# EAGLE design mainAD2S1200 (EAGLE 7.2.0)
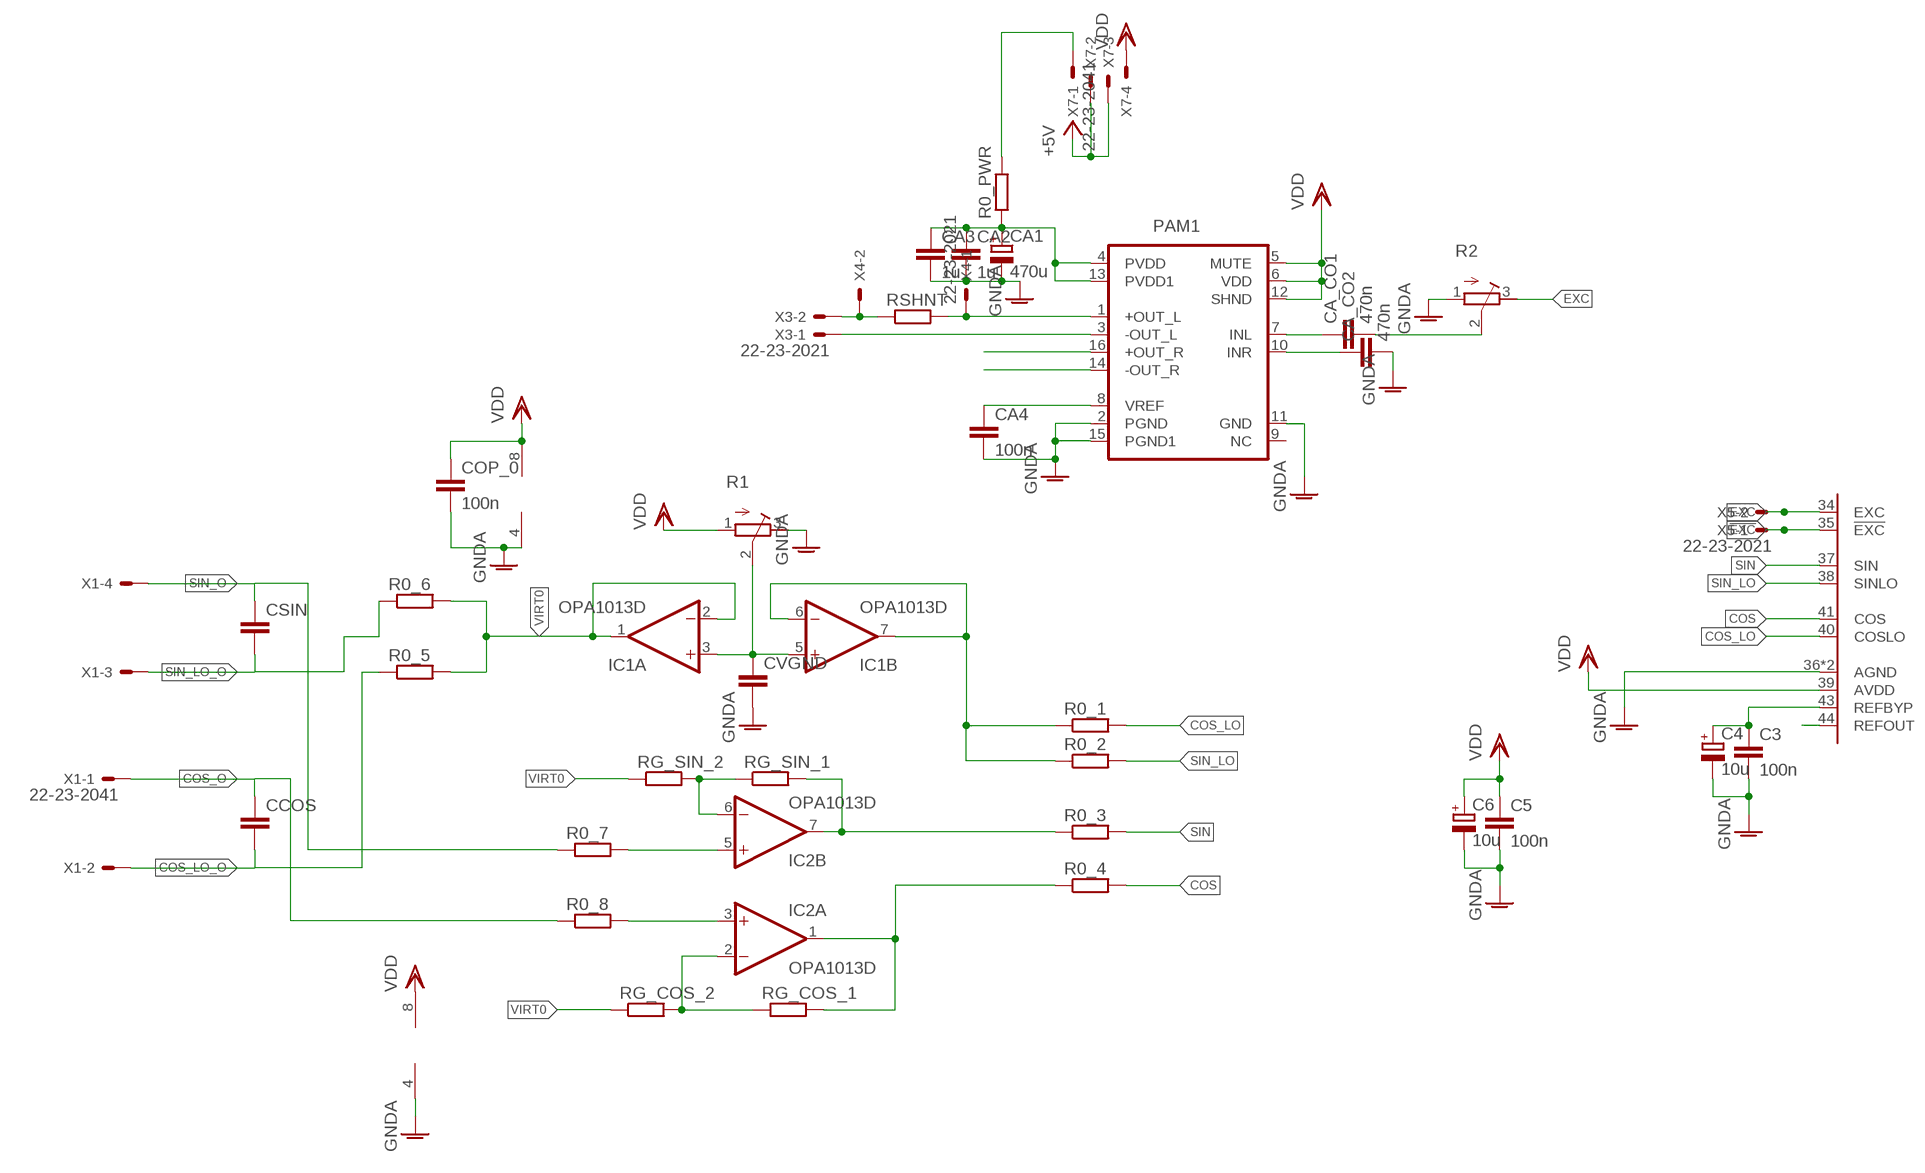
[diagram p0: schematic, sheet 1, part 1 of 2]
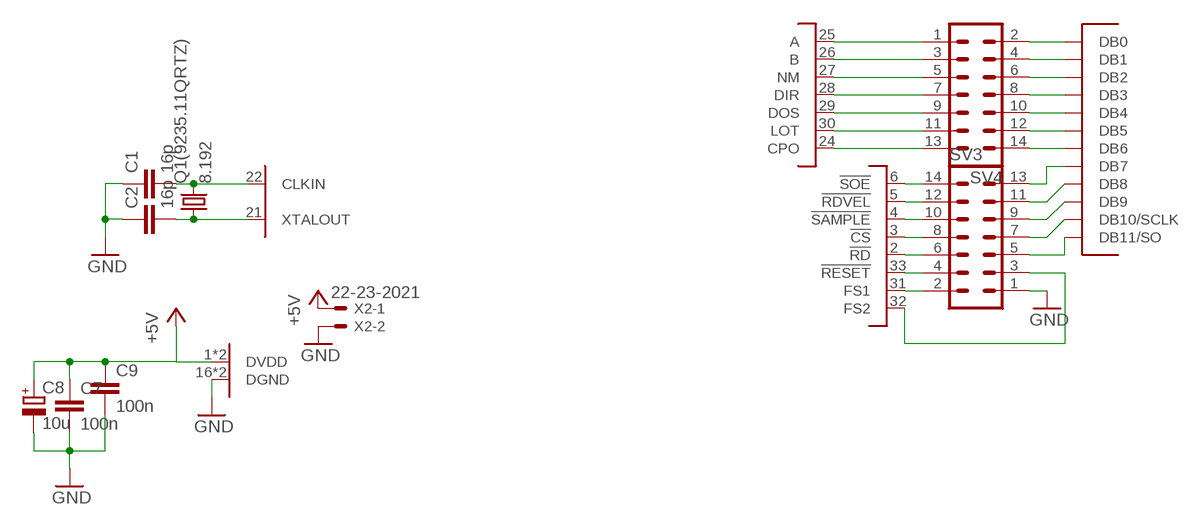
[diagram p1: schematic, sheet 1, part 2 of 2]

## Parts
C1  16p  C-EUC0805  [C0805]
C2  16p  C-EUC0805  [C0805]
C3  100n  C-EUC0805  [C0805]
C4  10u  CPOL-EUSMCA  [SMC_A]
C5  100n  C-EUC0805  [C0805]
C6  10u  CPOL-EUSMCA  [SMC_A]
C7  100n  C-EUC0805  [C0805]
C8  10u  CPOL-EUSMCA  [SMC_A]
C9  100n  C-EUC0805  [C0805]
CA1  470u  CPOL-EUE10-25  [EB25D]
CA2  1u  C-EUC1206  [C1206]
CA3  1u  C-EUC1206  [C1206]
CA4  100n  C-EUC0805  [C0805]
CA_CO1  470n  C-EUC0805  [C0805]
CA_CO2  470n  C-EUC0805  [C0805]
CCOS  C-EUC0805  [C0805]
COP_0  100n  C-EUC0805  [C0805]
CSIN  C-EUC0805  [C0805]
CVGND  C-EUC0805  [C0805]
IC1  OPA1013D  [SO08]
IC2  OPA1013D  [SO08]
PAM1  PAM8403  [SOP-16]
Q1(9235.11QRTZ)  8.192  CRYSTALCTS406  [CTS406]
R0_1  R-EU_R0805  [R0805]
R0_2  R-EU_R0805  [R0805]
R0_3  R-EU_R0805  [R0805]
R0_4  R-EU_R0805  [R0805]
R0_5  R-EU_R0805  [R0805]
R0_6  R-EU_R0805  [R0805]
R0_7  R-EU_R0805  [R0805]
R0_8  R-EU_R0805  [R0805]
R0_PWR  R-EU_R0805  [R0805]
R1  R-TRIMM64X  [RTRIM64X]
R2  R-TRIMM64X  [RTRIM64X]
RG_COS_1  R-EU_R0805  [R0805]
RG_COS_2  R-EU_R0805  [R0805]
RG_SIN_1  R-EU_R0805  [R0805]
RG_SIN_2  R-EU_R0805  [R0805]
RSHNT  R-EU_R0805  [R0805]
SV3  ML14  [ML14]
SV4  ML14  [ML14]
U$1  AD1S1200  [TQFP-44]
X1  22-23-2041  [22-23-2041]
X2  22-23-2021  [22-23-2021]
X3  22-23-2021  [22-23-2021]
X4  22-23-2021  [22-23-2021]
X5  22-23-2021  [22-23-2021]
X7  22-23-2041  [22-23-2041]

## Nets
!EXC: U$1.35(!EXC) X5.1
+5V: C7.1 C8.+ C9.1 U$1.1(DVDD) U$1.17(DVDD) X2.1 X7.2 X7.3
COS: R0_4.2 U$1.41(COS)
COS_LO: R0_1.2 U$1.40(COSLO)
COS_LO_O: CCOS.2 R0_5.1 X1.2
COS_O: CCOS.1 R0_8.1 X1.1
EXC: R2.3(E) U$1.34(EXC) X5.2
GND: C1.1 C2.1 C7.2 C8.- C9.2 SV3.1 U$1.16(DGND) U$1.23(DGND) X2.2
GNDA: C3.2 C4.- C5.2 C6.- CA1.- CA2.2 CA3.2 CA4.2 CA_CO2.2 COP_0.2 CVGND.2 IC1.4(P:V-) IC2.4(P:V-) PAM1.2(PGND) PAM1.11(GND) PAM1.15(PGND1) R1.3(E) R2.1(A) U$1.36(AGND) U$1.42(AGND)
N$1: C1.2 Q1(9235.11QRTZ).3 U$1.22(CLKIN)
N$2: C2.2 Q1(9235.11QRTZ).1 U$1.21(XTALOUT)
N$3: CA4.1 PAM1.8(VREF)
N$4: CA_CO1.1 PAM1.7(INL)
N$5: C3.1 C4.+ U$1.43(REFBYP)
N$6: CA_CO2.1 PAM1.10(INR)
N$7: IC1.6(B:-IN) IC1.7(B:OUT) R0_1.1 R0_2.1
N$8: PAM1.1(+OUT_L) RSHNT.2 X4.1
N$9: PAM1.3(-OUT_L) X3.1
N$10: PAM1.16(+OUT_R)
N$11: PAM1.14(-OUT_R)
N$12: IC2.7(B:OUT) R0_3.1 RG_SIN_1.2
N$13: IC2.1(A:OUT) R0_4.1 RG_COS_1.2
N$14: CVGND.1 IC1.3(A:+IN) IC1.5(B:+IN) R1.2(S)
N$15: SV4.2 U$1.20(DB0)
N$16: IC2.5(B:+IN) R0_7.2
N$17: IC2.3(A:+IN) R0_8.2
N$18: SV4.4 U$1.19(DB1)
N$19: IC2.6(B:-IN) RG_SIN_1.1 RG_SIN_2.2
N$20: IC2.2(A:-IN) RG_COS_1.1 RG_COS_2.2
N$21: SV4.6 U$1.18(DB2)
N$22: SV4.12 U$1.13(DB5)
N$23: SV4.14 U$1.12(DB6)
N$24: SV4.8 U$1.15(DB3)
N$25: SV4.10 U$1.14(DB4)
N$26: SV3.5 U$1.7(DB11/SO)
N$27: SV3.7 U$1.8(DB10/SCLK)
N$28: SV3.9 U$1.9(DB9)
N$29: SV3.11 U$1.10(DB8)
N$30: SV3.13 U$1.11(DB7)
N$31: SV4.11 U$1.30(LOT)
N$32: SV4.7 U$1.28(DIR)
N$33: SV4.9 U$1.29(DOS)
N$34: SV4.5 U$1.27(NM)
N$35: SV4.3 U$1.26(B)
N$36: SV4.1 U$1.25(A)
N$37: SV4.13 U$1.24(CPO)
N$38: SV3.6 U$1.2(!RD)
N$39: SV3.8 U$1.3(!CS)
N$40: SV3.10 U$1.4(!SAMPLE)
N$41: SV3.12 U$1.5(!RDVEL)
N$42: SV3.14 U$1.6(!SOE)
N$43: SV3.4 U$1.33(!RESET)
N$44: SV3.2 U$1.31(FS1)
N$45: SV3.3 U$1.32(FS2)
N$46: CA_CO1.2 R2.2(S)
N$47: RSHNT.1 X3.2 X4.2
N$48: CA1.+ CA2.1 CA3.1 PAM1.4(PVDD) PAM1.13(PVDD1) R0_PWR.1
N$49: R0_PWR.2 X7.1
N$50: U$1.44(REFOUT)
SIN: R0_3.2 U$1.37(SIN)
SIN_LO: R0_2.2 U$1.38(SINLO)
SIN_LO_O: CSIN.2 R0_6.1 X1.3
SIN_O: CSIN.1 R0_7.1 X1.4
VDD: C5.1 C6.+ COP_0.1 IC1.8(P:V+) IC2.8(P:V+) PAM1.5(MUTE) PAM1.6(VDD) PAM1.12(SHND) R1.1(A) U$1.39(AVDD) X7.4
VIRT0: IC1.1(A:OUT) IC1.2(A:-IN) R0_5.2 R0_6.2 RG_COS_2.1 RG_SIN_2.1
Unconnected: PAM1.9(NC)

## Library data of the parts
C1-C3 C5 C7 C9 CA4 CCOS COP_0 CSIN CVGND = rcl:C-EU: CAPACITOR, European symbol
C4 C6 C8 CA1 = resistor:CPOL-EU: POLARIZED CAPACITOR, European symbol
CA2 CA3 CA_CO1 CA_CO2 = resistor:C-EU: CAPACITOR, European symbol
IC1 IC2 = linear:OPA1013: OP AMP
PAM1 = PAM8403:PAM8403: Dual channel audio amplifier IC - PAM8403
Q1(9235.11QRTZ) = crystal:CRYSTAL: CRYSTAL; OC_FARNELL: unknown; OC_NEWARK: unknown
R0_1-R0_8 R0_PWR RG_COS_1 RG_COS_2 RG_SIN_1 RG_SIN_2 RSHNT = resistor:R-EU_: RESISTOR, European symbol
R1 R2 = resistor:R-TRIMM: Trimm resistor
SV3 SV4 = con-ml:ML14: HARTING; OC_FARNELL: unknown; OC_NEWARK: unknown
U$1 = ad2s1200:AD1S1200
X1 X7 = con-molex:22-23-2041: .100" (2.54mm) Center Header - 4 Pin; MF: MOLEX; MPN: 22-23-2041; OC_FARNELL: 1462920; OC_NEWARK: 38C0355
X2-X5 = con-molex:22-23-2021: .100" (2.54mm) Center Header - 2 Pin; MF: MOLEX; MPN: 22-23-2021; OC_FARNELL: 1462926; OC_NEWARK: 25C3832

## Board
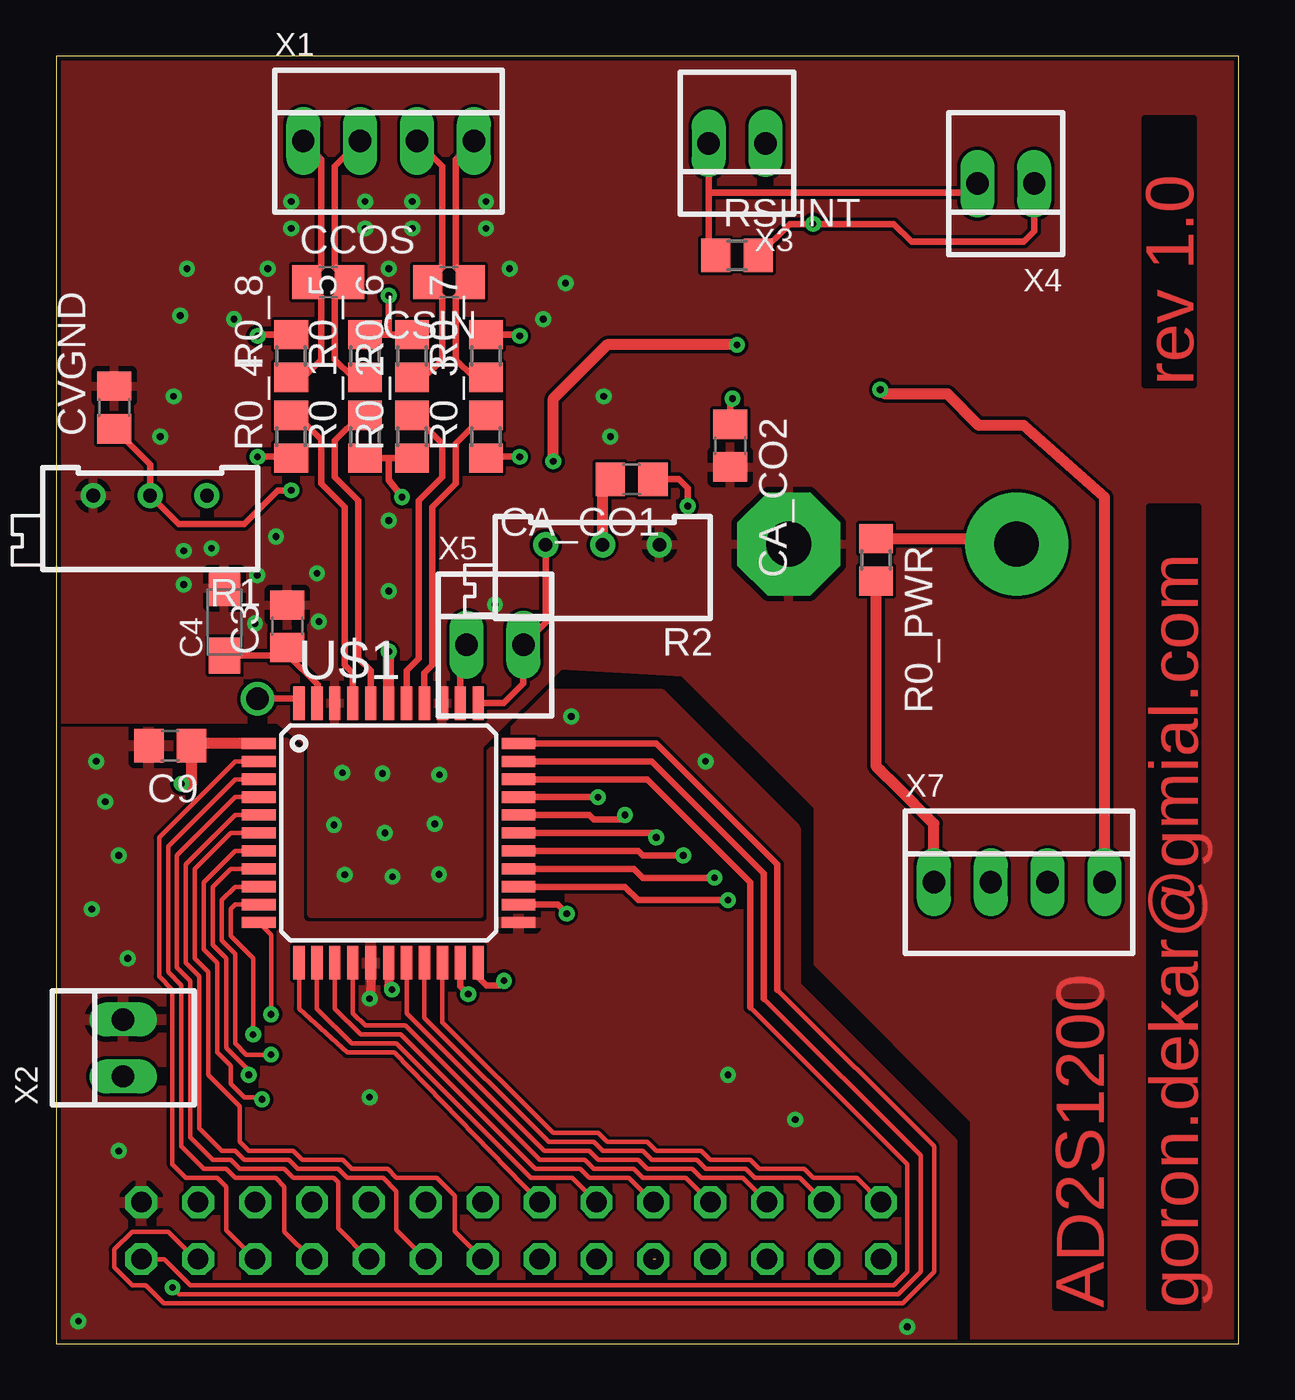
[diagram p2: board, top side]
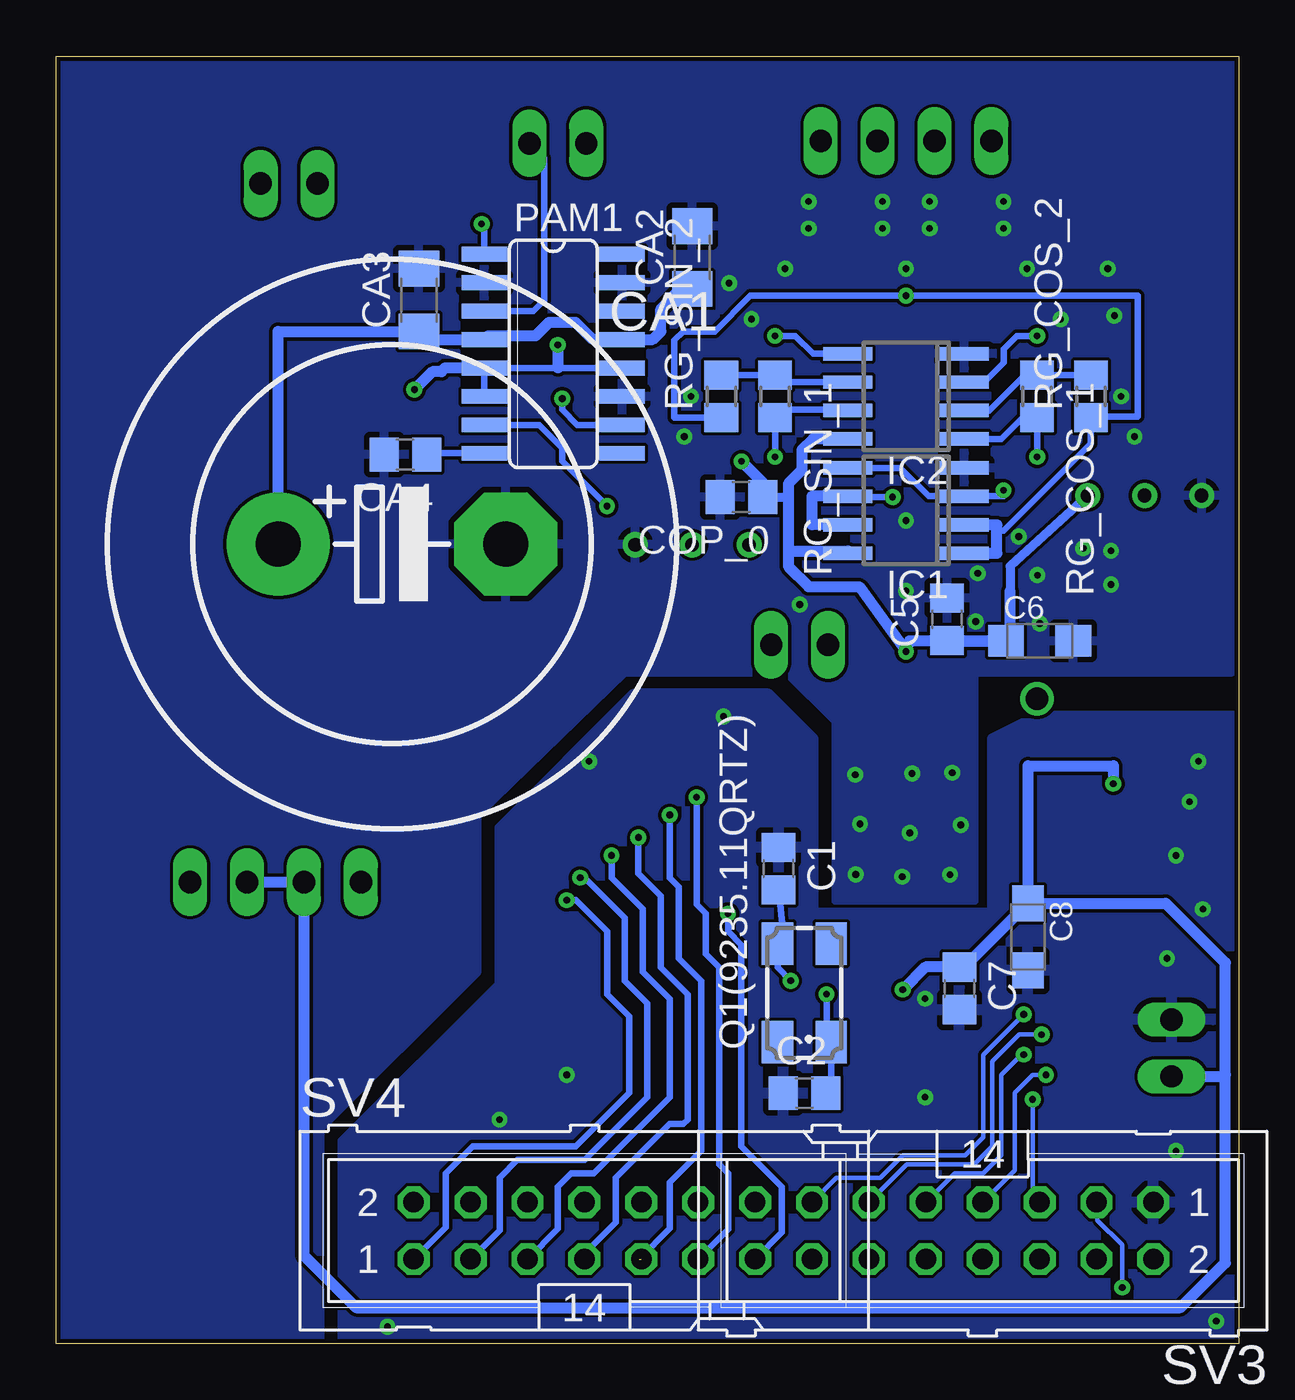
[diagram p3: board, bottom side, seen from below]

Size 52.8 x 57.5 mm. Coordinates in mm from the lower left corner, seen from the top.
Outline: 0,0 52.8,0 52.8,57.5 0,57.5 0,0
Copper layers (1*16): Top 0.018mm / dielectric 1.5mm / Bottom 0.018mm
Design rules "0.15": minimum track width 0.15mm, minimum drill 0.3mm, track to track 0.15mm, track to pad 0.15mm, pad to pad 0.15mm, via to via 0.15mm, smd to smd 0mil, copper to edge 0.2mm, drill to drill 0.2mm, minimum pad ring 10mil, minimum via ring 8mil, stop-mask expansion 4mil, vias tented up to drill 0.5mm, thermal gap 10mil

### Footprints (pad centres in the part's own frame; a part is rotated, then mirrored left to right if it is on the bottom)
C0805 = smd 1.3 x 1.5: 1 -0.95,0; 2 0.95,0
SMC_A = smd 1.6 x 1.4: + -1.5,0; - 1.5,0
EB25D = drill 2.007 pad 4.597: + -5.08,0 | drill 2.007 pad 4.597 octagon: - 5.08,0
C1206 = smd 1.6 x 1.8: 1 -1.4,0; 2 1.4,0
SO08 = smd 0.6 x 2.2: 1 -1.905,-2.6; 2 -0.635,-2.6; 3 0.635,-2.6; 4 1.905,-2.6; 5 1.905,2.6; 6 0.635,2.6; 7 -0.635,2.6; 8 -1.905,2.6
SOP-16 = smd 0.66 x 2.032: 1 -4.445,-3.073; 2 -3.175,-3.073; 3 -1.905,-3.073; 4 -0.635,-3.073; 5 0.635,-3.073; 6 1.905,-3.073; 7 3.175,-3.073; 8 4.445,-3.073; 9 4.445,3.073; 10 3.175,3.073; 11 1.905,3.073; 12 0.635,3.073; 13 -0.635,3.073; 14 -1.905,3.073; 15 -3.175,3.073; 16 -4.445,3.073
CTS406 = smd 1.9 x 1.4: 1 -2.2,-1.2; 2 2.2,-1.2; 3 2.2,1.2; 4 -2.2,1.2
R0805 = smd 1.3 x 1.5: 1 -0.95,0; 2 0.95,0
RTRIM64X = drill 0.61: 1 1.27,-2.54; 2 1.27,0; 3 1.27,2.54
ML14 = drill 0.914 octagon: 1 -7.62,-1.27; 2 -7.62,1.27; 3 -5.08,-1.27; 4 -5.08,1.27; 5 -2.54,-1.27; 6 -2.54,1.27; 7 0,-1.27; 8 0,1.27; 9 2.54,-1.27; 10 2.54,1.27; 11 5.08,-1.27; 12 5.08,1.27; 13 7.62,-1.27; 14 7.62,1.27
TQFP-44 = smd 1.5 x 0.5: 1 -5.8,4; 2 -5.8,3.2; 3 -5.8,2.4; 4 -5.8,1.6; 5 -5.8,0.8; 6 -5.8,0; 7 -5.8,-0.8; 8 -5.8,-1.6; 9 -5.8,-2.4; 10 -5.8,-3.2; 11 -5.8,-4; 23 5.8,-4; 24 5.8,-3.2; 25 5.8,-2.4; 26 5.8,-1.6; 27 5.8,-0.8; 28 5.8,0; 29 5.8,0.8; 30 5.8,1.6; 31 5.8,2.4; 32 5.8,3.2; 33 5.8,4 | smd 0.5 x 1.5: 12 -4,-5.8; 13 -3.2,-5.8; 14 -2.4,-5.8; 15 -1.6,-5.8; 16 -0.8,-5.8; 17 0,-5.8; 18 0.8,-5.8; 19 1.6,-5.8; 20 2.4,-5.8; 21 3.2,-5.8; 22 4,-5.8; 34 4,5.8; 35 3.2,5.8; 36 2.4,5.8; 37 1.6,5.8; 38 0.8,5.8; 39 0,5.8; 40 -0.8,5.8; 41 -1.6,5.8; 42 -2.4,5.8; 43 -3.2,5.8; 44 -4,5.8
22-23-2041 = drill 1 long: 1 -3.81,0; 2 -1.27,0; 3 1.27,0; 4 3.81,0
22-23-2021 = drill 1 long: 1 -1.27,0; 2 1.27,0

### Placement (x,y rotation side)
C1  20.54,21.21 270 bottom
C2  19.39,11.18 0 bottom
C3  10.32,32.03 90 top
C4  7.52,32.23 90 top
C5  13.02,32.34 90 bottom
C6  8.89,31.38 0 bottom
C7  12.47,15.86 270 bottom
C8  9.41,18.16 270 bottom
C9  5.1,26.7 180 top
CA1  37.8,35.7 0 bottom
CA2  24.4,48.5 90 bottom
CA3  36.6,46.6 90 bottom
CA4  37.2,39.7 180 bottom
CA_CO1  25.7,38.6 180 top
CA_CO2  30.1,40.1 270 top
CCOS  12.15,47.4 0 top
COP_0  22.2,37.8 180 bottom
CSIN  17.55,47.4 180 top
CVGND  2.6,41.8 90 top
IC1  14.85,37.2 90 bottom
IC2  14.85,42.3 90 bottom
PAM1  30.6,44.2 270 bottom
Q1(9235.11QRTZ)  19.39,15.66 90 bottom
R0_1  13.8,40.5 90 top
R0_2  15.9,40.5 90 top
R0_3  19.2,40.5 90 top
R0_4  10.5,40.5 90 top
R0_5  13.8,44.1 90 top
R0_6  15.9,44.1 90 top
R0_7  19.2,44.1 90 top
R0_8  10.5,44.1 90 top
R0_PWR  36.6,35 270 top
R1  4.2,36.6 90 top
R2  24.4,34.4 90 top
RG_COS_1  9,42.3 270 bottom
RG_COS_2  6.6,42.3 90 bottom
RG_SIN_1  20.7,42.3 270 bottom
RG_SIN_2  23.1,42.3 90 bottom
RSHNT  30.4,48.6 0 top
SV3  11.43,5.04 180 bottom
SV4  29.21,5.04 0 bottom
U$1  14.85,22.8 0 top
X1  14.85,53.7 0 top
X2  3,13.2 90 top
X3  30.4,53.6 180 top
X4  42.4,51.8 180 top
X5  19.6,31.2 0 top
X7  43,20.6 0 top

### Tracks (layer width: path | path; a pad name or v marks a point on that pad's centre or on a via)
!EXC
  Top 0.3: U$1.35 18.05,30.92 X5.1
+5V  (via drill 0.3)
  Top 0.4: U$1.17 14.85,15.95 v15,15.8
  Top 0.5: U$1.1 6.15,26.8 C9.1 6.05,25 v5.6,25
  Bottom 0.5: C8.+ 9.4,25.8 5.6,25.8 v5.6,25 | 0.6,12 0.6,3.6 2.6,1.6 39.4,1.6 41.73,3.93 X7.2 X7.3 | 0.6,12 0.6,17 3.26,19.66 C8.+ | X2.1 0.87,11.93 0.6,12 | C8.+ 12.26,16.81 C7.1 13.99,16.81 v15,15.8
COS
  Top 0.3: U$1.41 13.25,29.95 12.9,30.3 12.9,37.35 11.85,38.4 11.85,40.36 10.76,41.45 R0_4.2
COS_LO
  Top 0.3: U$1.40 14.05,30.05 13.5,30.6 13.5,37.65 12.45,38.7 12.45,40.33 13.57,41.45 R0_1.2
COS_LO_O
  Top 0.3: R0_5.1 13.25,43.15 12.45,43.95 12.45,46.75 CCOS.2 12.45,48.05 12.45,52.57 X1.2
COS_O
  Top 0.3: R0_8.1 11.05,43.15 11.85,43.95 11.85,46.75 CCOS.1 11.85,48.05 11.85,52.89 X1.1
EXC
  Top 0.3: U$1.34 20,28.6 20.87,29.47 X5.2 21.86,32.19 R2.3
GND  (via drill 0.3)
  Top 0.4: U$1.16 14.05,15.85 v14,15.4
  other vias: 30,12 33,10 29,26 23,28 14,11 2.8,21.8 2.2,24.2 1.6,19.4 3.2,17.2 1.8,26 2.8,8.6 1,1 38,0.75
  pour Bottom (rank 2): 0,28 9,28 11,27 11,19.2 19,19.2 19,27 21,29 27,29 33,23 33,16 40,9 40,0 0,0
  pour Top (rank 2): 0,28 9,28 11,27 11,19 19,19 19,27 21,29 27,29 33,23 33,16 40,9 40,0 0,0
GNDA  (via drill 0.3)
  other vias: 14.85,33.6 5.7,35.4 5.7,33.9 10.5,49.8 13.8,49.8 15.9,49.8 19.2,49.8 19.2,51 15.9,51 13.8,51 10.5,51 14.85,48 9.45,48 7.95,45.75 20.25,48 21.75,45.75 5.85,48 5.55,45.9 5.25,42.3 22.75,47.35 24.45,42.3 24.75,40.5 4.65,40.5 14.85,36.75 19.6,33 11.65,34.4 11.74,32.25 8.99,34.31 8.88,32.15 6.94,35.51 9.82,36.04 12.78,25.49 14.58,25.46 17.12,25.4 16.91,23.2 14.68,22.8 12.41,23.16 12.89,20.93 17.1,20.95 15.02,20.85
  pour Top: 9.9,27.9 11.4,26.7 11.4,19.2 18.9,19.2 18.9,26.7 22.5,30.3 28,30 34,24 34,17 41,10 41,0 53,0 53,30.3 53.3,58.6 0.3,58.6 0,27.9
  pour Bottom: 0.3,30 0.3,57.4 53,57.4 53,0 41,0 41,9.6 34,16.6 34,23.6 27.4,30 20.2,30 18,27.8 18,19.8 11.8,19.8 11.8,30
N$1  (via drill 0.3)
  Top 0.3: U$1.22 18.85,16.35 19.2,16 19.8,16 v20,16.2
  Bottom 0.3: v20,16.2 20.59,16.79 Q1(9235.11QRTZ).3 20.34,18.31 C1.2
N$2  (via drill 0.3)
  Top 0.3: U$1.21 18.05,15.95 v18.4,15.6
  Bottom 0.3: v18.4,15.6 18.4,13.67 Q1(9235.11QRTZ).1 18.19,11.63 C2.2
N$3
  Bottom 0.3: PAM1.8 36.2,39.76 CA4.1
N$4  (via drill 0.3)
  Top 0.3: 27,38.6 27.8,38.6 28.2,38.2 v28.2,37.4
  Top 0.5: CA_CO1.1 27,38.6
  Bottom 0.3: PAM1.7 31.23,41.02 30.2,40 30.2,39.4 v28.2,37.4
N$5
  Top 0.3: U$1.43 11.68,29.42 10.32,30.77 | 10.32,30.77 C3.1 | 10.32,30.77 10.28,30.73 C4.+
N$6  (via drill 0.3)
  Top 0.3: CA_CO2.1 30.1,42.1 v30.2,42.2
  Bottom 0.3: PAM1.10 29.52,41.02 30.2,41.7 v30.2,42.2
N$7  (via drill 0.3)
  Top 0.3: R0_1.1 14.75,39.55 | 14.75,39.55 R0_2.1 | v15.45,37.8 14.85,38.55 14.85,39.45 14.75,39.55
  Bottom 0.3: IC1.6 17.41,37.8 v15.45,37.8
  Bottom 0.5: IC1.6 19.05,37.84 19.05,36.56 IC1.7
N$8  (via drill 0.3)
  Top 0.3: RSHNT.2 32.75,50 v33.8,50 37.4,50 38.2,49.2 43.2,49.2 43.67,49.67 X4.1
  Bottom 0.3: PAM1.1 33.67,49.87 v33.8,50
N$9
  Bottom 0.3: PAM1.3 31.5,46.1 31,46.6 31,52.93 X3.1
N$12  (via drill 0.3)
  Top 0.3: R0_3.1 19.25,39.6 v20.7,39.6
  Bottom 0.3: IC2.7 17.57,41.7 20.35,41.7 RG_SIN_1.2 v20.7,39.6 20.7,39.9
N$13  (via drill 0.3)
  Top 0.3: R0_4.1 10.45,39.6 v9,39.6
  Bottom 0.3: IC2.1 10.61,40.4 9.65,41.35 RG_COS_1.2 v9,39.6
N$14  (via drill 0.3)
  Top 0.3: v10.5,38.1 9.9,38.1 8.4,36.6 5.47,36.6 R1.2 4.2,39.25 CVGND.1
  Bottom 0.3: IC1.5 15.11,39.1 13.84,37.84 IC1.3 10.5,37.84 v10.5,38.1
N$15
  Top 0.2: U$1.20 17.25,14.35 22.2,9.4 24.2,9.4 24.6,9 26.4,9 26.8,8.6 28.8,8.6 29.2,8.2 31,8.2 31.4,7.8 33.4,7.8 33.8,7.4 35.74,7.4 SV4.2
N$16  (via drill 0.3)
  Top 0.3: R0_7.2 20.65,45.05 v20.7,45
  Bottom 0.3: IC2.5 19,44.2 19.8,45 v20.7,45
N$17  (via drill 0.3)
  Top 0.3: R0_8.2 9.05,45.05 v9,45
  Bottom 0.3: IC2.3 11.37,42.94 10.5,43.8 10.5,44.4 9.9,45 v9,45
N$18
  Top 0.2: U$1.19 16.45,14.55 22,9 24,9 24.4,8.6 26.2,8.6 26.6,8.2 28.6,8.2 29,7.8 30.8,7.8 31.2,7.4 33.2,7.4 SV4.4
N$19
  Bottom 0.3: RG_SIN_2.2 RG_SIN_1.1 20.39,42.94 IC2.6
N$20
  Bottom 0.3: RG_COS_2.2 RG_COS_1.1 9.55,43.25 11.13,41.66 IC2.2
N$21
  Top 0.2: U$1.18 15.65,14.75 21.8,8.6 23.8,8.6 24.2,8.2 26,8.2 26.4,7.8 28.4,7.8 28.8,7.4 30.66,7.4 SV4.6
N$22
  Top 0.2: U$1.13 11.65,14.95 13.2,13.4 15.2,13.4 21.2,7.4 23.04,7.4 SV4.12
N$23
  Top 0.2: U$1.12 10.85,14.95 13,13 15.1,13 SV4.14
N$24
  Top 0.2: U$1.15 13.25,14.75 13.8,14.2 15.6,14.2 21.6,8.2 23.6,8.2 24,7.8 25.8,7.8 26.2,7.4 28.12,7.4 SV4.8
N$25
  Top 0.2: U$1.14 12.45,14.95 13.6,13.8 15.4,13.8 21.4,7.8 23.4,7.8 23.8,7.4 25.58,7.4 SV4.10
N$26  (via drill 0.3)
  Top 0.2: U$1.7 8,22 6.6,20.6 6.6,17.6 7.2,17 7.2,13 7.8,12.4 7.8,11.6 8.4,11 9.1,11 v9.2,10.9
  Bottom 0.2: SV3.5 9.2,6.62 v9.2,10.9
N$27  (via drill 0.3)
  Top 0.2: v8.6,12 8.6,12.2 7.6,13.2 7.6,17.2 7,17.8 7,20.4 7.8,21.2 U$1.8
  Bottom 0.2: SV3.7 10,7.74 10,11.2 9.2,12 v8.6,12
N$28  (via drill 0.3)
  Top 0.2: v9.6,12.9 8.5,12.9 8,13.4 8,17.4 7.4,18 7.4,19.8 8,20.4 U$1.9
  Bottom 0.2: SV3.9 12.68,7.6 11.4,7.6 10.6,8.4 10.6,12 9.7,12.9 v9.6,12.9
N$29  (via drill 0.3)
  Top 0.2: v8.8,13.8 8.8,17.2 7.8,18.2 7.8,19.4 8,19.6 U$1.10
  Bottom 0.2: SV3.11 14.82,8 11.8,8 11,8.8 11,12.6 9.8,13.8 v8.8,13.8
N$30  (via drill 0.3)
  Top 0.2: v9.6,14.7 9.6,18.25 U$1.11
  Bottom 0.2: v9.6,14.7 11.4,12.9 11.4,9.2 12.2,8.4 15,8.4 16,7.4 17.96,7.4 SV3.13
N$31  (via drill 0.3)
  Top 0.3: U$1.30 v24.2,24.4
  Bottom 0.3: v24.2,24.4 24.2,19.6 23.8,19.2 23.8,17.4 23.2,16.8 23.2,8 22.8,7.6 22.8,5.1 SV4.11
N$32  (via drill 0.3)
  Top 0.3: U$1.28 26.6,22.8 v26.8,22.6
  Bottom 0.3: SV4.7 29.21,4.01 27.8,5.42 27.8,7.4 25.4,9.8 24.8,9.8 24.6,10 24.6,15.6 25.8,16.8 25.8,20 26.8,21 v26.8,22.6
N$33  (via drill 0.3)  (1 unrouted)
  Top 0.3: U$1.29 23.8,23.6 24,23.4 25.2,23.4 v25.4,23.6
  Bottom 0.3: 26.77,3.77 25.4,5.14 25.4,7.2 24,8.6 24,16.2 25,17.2 25,20.4 25.4,20.8 v25.4,23.6
N$34  (via drill 0.3)
  Top 0.3: U$1.27 26,22 26.2,21.8 v28,21.8
  Bottom 0.3: SV4.5 30.4,5.12 30.4,7 29.8,7.6 28.8,7.6 25.4,11 25.4,15.4 26.6,16.6 26.6,19.4 28,20.8 v28,21.8
N$35  (via drill 0.3)
  Top 0.3: U$1.26 25.8,21.2 26.2,20.8 v29.4,20.8
  Bottom 0.3: SV4.3 33,5.06 33,7.4 32.2,8.2 29.2,8.2 26.4,11 26.4,15.2 27.4,16.2 27.4,19 29.2,20.8 v29.4,20.8
N$36  (via drill 0.3)
  Top 0.3: U$1.25 25.4,20.4 26,19.8 v30,19.8
  Bottom 0.3: SV4.1 35.4,5.2 35.4,7.6 34.2,8.8 29.6,8.8 27.2,11.2 27.2,14.6 28.2,15.6 28.2,18.4 29.6,19.8 v30,19.8
N$37  (via drill 0.3)
  Top 0.3: U$1.24 22.4,19.6 v22.8,19.2
  Bottom 0.3: SV4.13 20.4,4.96 20.4,7 22.2,8.8 22.2,17.8 22.8,18.4 v22.8,19.2
N$38
  Top 0.2: SV3.6 7.6,5.06 7.6,7 7.2,7.4 5.8,7.4 5.2,8 5.2,15.8 4.6,16.4 4.6,22.6 8,26 U$1.2
N$39
  Top 0.2: SV3.8 10.2,5 10.2,7 9.8,7.4 8,7.4 7.6,7.8 6.6,7.8 5.6,8.8 5.6,16 5,16.6 5,22.2 8,25.2 U$1.3
N$40
  Top 0.2: SV3.10 12.6,5.14 12.6,7.2 12.4,7.4 10.6,7.4 10.2,7.8 8.2,7.8 7.8,8.2 7,8.2 6,9.2 6,16.2 5.4,16.8 5.4,21.8 8,24.4 U$1.4
N$41
  Top 0.2: SV3.12 15.2,5.08 15.2,6.8 14.6,7.4 13,7.4 12.6,7.8 10.8,7.8 10.4,8.2 8.4,8.2 8,8.6 7.4,8.6 6.4,9.6 6.4,16.4 5.8,17 5.8,21.4 8,23.6 U$1.5
N$42
  Top 0.2: SV3.14 17.8,5.02 17.8,6.6 17,7.4 15.2,7.4 14.8,7.8 13.2,7.8 12.8,8.2 11,8.2 10.6,8.6 8.6,8.6 8.2,9 8.2,10.6 6.8,12 6.8,16.6 6.2,17.2 6.2,21.2 7.8,22.8 U$1.6
N$43
  Top 0.2: 32.2,15.8 39.2,8.8 39.2,3.2 37.8,1.8 4.8,1.8 4,2.6 3.4,2.6 2.6,3.4 2.6,4.2 3.4,5 5,5 6.23,3.77 SV3.4
  Top 0.3: 32.2,15.8 32.2,21.4 26.8,26.8 U$1.33
N$44
  Top 0.2: 31,15 38,8 38,3.2 37.4,2.6 6,2.6 4.83,3.77 SV3.2
  Top 0.3: U$1.31 26.4,25.2 31,20.6 31,15
N$45  (via drill 0.3)
  Top 0.2: 31.6,15.4 38.6,8.4 38.6,3.2 37.6,2.2 5.5,2.2 v5.2,2.5
  Top 0.3: 31.6,15.4 31.6,21 26.6,26 U$1.32
  Bottom 0.2: 6.31,6.31 6.31,5.51 5.2,4.4 v5.2,2.5
  Bottom 0.3: SV3.3 6.31,6.31
N$46
  Top 0.5: R2.2 24.4,38.25 CA_CO1.2
N$47
  Top 0.3: X3.2 29.13,51.4 | 29.13,51.4 29.13,48.92 RSHNT.1 | X4.2 40.73,51.4 29.13,51.4
N$48
  Top 0.5: R0_PWR.1 42.63,35.95 CA1.+
  Bottom 0.5: CA2.1 24.9,47.1 25.8,46.2 25.8,45.2 26.16,44.84 PAM1.13 28.84,44.84 29.6,45.6 30.8,45.6 31.4,45 33.51,45 PAM1.4 36.23,44.84 CA3.1 42.88,45.2 CA1.+
N$49
  Top 0.5: X7.1 39.19,23.21 37.5,24.9 36.8,25.6 36.6,25.8 R0_PWR.2
N$50  (via drill 1)
  Top 0.3: v9,28.8 10.65,28.8 U$1.44
SIN
  Top 0.3: U$1.37 16.45,29.95 16.8,30.3 16.8,37.35 17.85,38.4 17.85,40.2 19.1,41.45 R0_3.2
SIN_LO
  Top 0.3: U$1.38 15.65,30.05 16.2,30.6 16.2,37.65 17.25,38.7 17.25,40.2 16,41.45 R0_2.2
SIN_LO_O
  Top 0.3: R0_6.1 16.45,43.15 17.25,43.95 17.25,46.75 CSIN.2 17.25,48.05 17.25,52.57 X1.3
SIN_O
  Top 0.3: R0_7.1 18.65,43.15 17.85,43.95 17.85,46.75 CSIN.1 17.85,48.05 17.85,52.89 X1.4
VDD  (via drill 0.3)
  Top 0.5: U$1.39 v14.85,30.9 | X7.4 46.81,37.79 43.2,41 41.2,41 39.8,42.4 37,42.4 v36.8,42.6 | v30.4,44.6 24.6,44.6 22.2,42.2 v22.2,39.4
  Bottom 0.3: PAM1.12 30.4,43.56 PAM1.5 PAM1.6
  Bottom 0.4: R1.1 10.2,34.71 10.2,33.6 | COP_0.1 20.1,37.8
  Bottom 0.5: C5.1 14.7,31.39 v14.85,30.9 16.95,33.8 19.2,33.8 20.1,34.7 20.1,35.4 | C5.1 C6.+ | C5.1 10.2,31.39 10.2,33.6 | 20.1,35.4 20.1,37.8 20.1,38.4 19.5,39 19.5,39.9 19,40.4 IC2.8 | 20.1,35.4 17.45,35.4 IC1.8 | COP_0.1 21.25,38.45 v22.2,39.4 | v30.4,44.6 30.4,43.56 | PAM1.5 35.44,43.56 35.6,43.4 36,43.4 v36.8,42.6
VIRT0  (via drill 0.3)
  Top 0.3: R0_5.2 15,45.05 | 15,45.05 R0_6.2 | v14.85,46.8 14.85,45.2 arc90 15,45.05
  Bottom 0.3: 10.8,36.3 10.5,36.3 6.6,40.2 RG_COS_2.1 6.55,41.4 4.5,41.4 4.5,46.8 v14.85,46.8 21.8,46.8 23.4,45.2 24.8,45.2 25.2,44.8 25.2,41.35 RG_SIN_2.1
  Bottom 0.5: IC1.2 10.8,36.56 10.8,36.3 10.8,35.3 IC1.1

### Text on the board
Top: rev 1.0 | AD2S1200 | goron.dekar@gmial.com